# Altium schematic sheet MCU.SchDoc: =ProjectTitle
size 297 x 209 mm; Address1: Address1; Address2: Address2; Address3: Address3; Address4: Address4; SheetNumber: 1; SheetTotal: 6; Scale: 1:1; DocumentType: Схема электрическая принципиальная; Title2str: ?
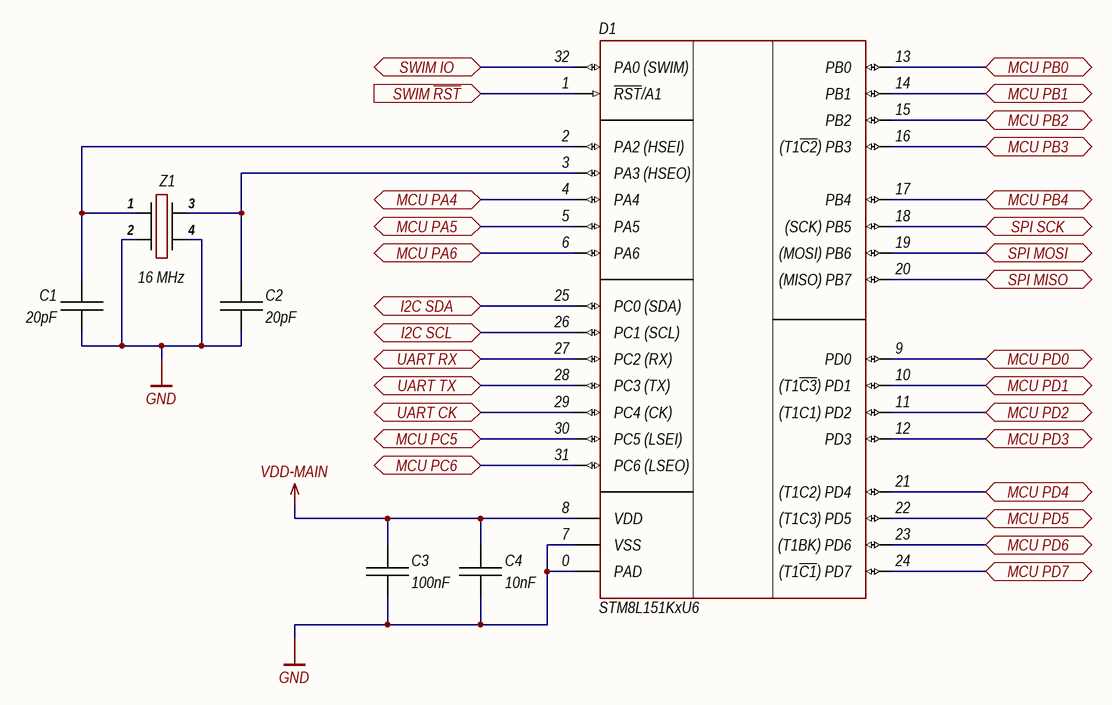
[diagram p0: MCU.SchDoc]

## Parts
C1  20pF  [CH0402C]
C2  20pF  [CH0402C]
C3  100nF  [CH0402C]
C4  10nF  [CH0402C]
D1  STM8L151KxU6  [32-UFQFPN]
Z1  16 MHz  [OSC: 3225]

## Ports
I2C SCL (bidir), I2C SDA (bidir), MCU PA4 (bidir), MCU PA5 (bidir), MCU PA6 (bidir), MCU PB0 (bidir), MCU PB1 (bidir), MCU PB2 (bidir), MCU PB3 (bidir), MCU PB4 (bidir), MCU PC5 (bidir), MCU PC6 (bidir), MCU PD0 (bidir), MCU PD1 (bidir), MCU PD2 (bidir), MCU PD3 (bidir), MCU PD4 (bidir), MCU PD5 (bidir), MCU PD6 (bidir), MCU PD7 (bidir), SPI MISO (bidir), SPI MOSI (bidir), SPI SCK (bidir), SWIM IO (bidir), SWIM ~{RST} (in), UART CK (bidir), UART RX (bidir), UART TX (bidir)

## Nets
GND: C1.1 C2.1 C3.1 C4.1 D1.0(PAD) D1.7(VSS) Z1.2 Z1.4
VDD-MAIN: C3.2 C4.2 D1.8(VDD)
I2C SCL: D1.26(PC1_(SCL)) ; port I2C SCL
I2C SDA: D1.25(PC0_(SDA)) ; port I2C SDA
MCU PA4: D1.4(PA4) ; port MCU PA4
MCU PA5: D1.5(PA5) ; port MCU PA5
MCU PA6: D1.6(PA6) ; port MCU PA6
MCU PB0: D1.13(PB0) ; port MCU PB0
MCU PB1: D1.14(PB1) ; port MCU PB1
MCU PB2: D1.15(PB2) ; port MCU PB2
MCU PB3: D1.16((T1~{C2})_PB3) ; port MCU PB3
MCU PB4: D1.17(PB4) ; port MCU PB4
MCU PC5: D1.30(PC5_(LSEI)) ; port MCU PC5
MCU PC6: D1.31(PC6_(LSEO)) ; port MCU PC6
MCU PD0: D1.9(PD0) ; port MCU PD0
MCU PD1: D1.10((T1~{C3})_PD1) ; port MCU PD1
MCU PD2: D1.11((T1C1)_PD2) ; port MCU PD2
MCU PD3: D1.12(PD3) ; port MCU PD3
MCU PD4: D1.21((T1C2)_PD4) ; port MCU PD4
MCU PD5: D1.22((T1C3)_PD5) ; port MCU PD5
MCU PD6: D1.23((T1BK)_PD6) ; port MCU PD6
MCU PD7: D1.24((T1~{C1})_PD7) ; port MCU PD7
SPI MISO: D1.20((MISO)_PB7) ; port SPI MISO
SPI MOSI: D1.19((MOSI)_PB6) ; port SPI MOSI
SPI SCK: D1.18((SCK)_PB5) ; port SPI SCK
SWIM IO: D1.32(PA0_(SWIM)) ; port SWIM IO
SWIM ~{RST}: D1.1(~{RST}/A1) ; port SWIM ~{RST}
UART CK: D1.29(PC4_(CK)) ; port UART CK
UART RX: D1.27(PC2_(RX)) ; port UART RX
UART TX: D1.28(PC3_(TX)) ; port UART TX
NetC1_2: C1.2 D1.2(PA2_(HSEI)) Z1.1
NetC2_2: C2.2 D1.3(PA3_(HSEO)) Z1.3

## Notes on the sheet
- Утв.
- Н.контр.
- Т.контр.
- Пров.
- Разраб.
- Изм.
- Лист
- № докум.
- Подп.
- Дата
- Копировал
- Формат А4
- Лит.
- Листов
- Масса
- Масштаб

## Library data of the parts
C1 C2 = Capacitor: Manufacturer: YAGEO; Model: CC0402JRNPO9BN200; HelpURL: https://lcsc.com/product-detail/Multilayer-Ceramic-Capacitors-MLCC-SMD-SMT_YAGEO-CC0402JRNPO9BN200_C107000.html; ComponentKind: NP0, 50V; Value: 20pF
C3 = Capacitor: Manufacturer: CCTC; Model: TCC0402X7R104K250AT; HelpURL: https://lcsc.com/product-detail/Multilayer-Ceramic-Capacitors-MLCC-SMD-SMT_CCTC-TCC0402X7R104K250AT_C466234.html; ComponentKind: X7R, 50V; Value: 100nF
C4 = Capacitor: Manufacturer: CCTC; Model: TCC0402X7R103M500AT; HelpURL: https://lcsc.com/product-detail/Multilayer-Ceramic-Capacitors-MLCC-SMD-SMT_CCTC-TCC0402X7R103M500AT_C696856.html; ComponentKind: X7R, 50V; Value: 10nF
D1 = STM8L151KxU6: STM8; Manufacturer: ST Microelectronics; Model: STM8L151KxU6; ComponentKind: 1.8-3.6V, UFQFPN32; HelpURL: https://ru.mouser.com/datasheet/2/389/stm8l151c4-956418.pdf
Z1 = Generator: Manufacturer: JWT; Model: JF4016M00020T8188090; HelpURL: https://lcsc.com/product-detail/SMD-Crystal-Resonators_JWT-JF4016M00020T8188090_C726643.html; ComponentKind: ±10ppm 20pF 60Ω; Value: 16 MHz